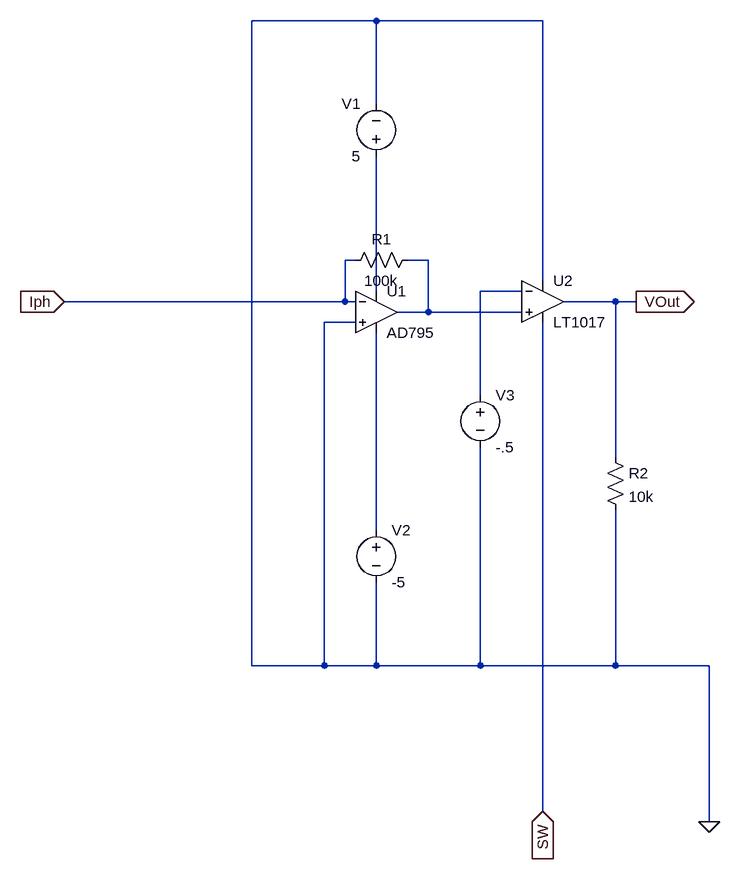
[diagram p0: schematic Synapse_v2.asc]
Synapse_v2.asc, the LTspice schematic file:
Version 4
SHEET 1 980 916
WIRE 272 -384 80 -384
WIRE 528 -384 272 -384
WIRE 272 -256 272 -384
WIRE 240 -16 224 -16
WIRE 352 -16 320 -16
WIRE 528 16 528 -384
WIRE 272 32 272 -176
WIRE 496 32 432 32
WIRE 224 48 224 -16
WIRE 224 48 -208 48
WIRE 240 48 224 48
WIRE 640 48 560 48
WIRE 672 48 640 48
WIRE 352 64 352 -16
WIRE 352 64 304 64
WIRE 496 64 352 64
WIRE 240 80 192 80
WIRE 432 192 432 32
WIRE 640 288 640 48
WIRE 272 400 272 96
WIRE 80 608 80 -384
WIRE 192 608 192 80
WIRE 192 608 80 608
WIRE 272 608 272 480
WIRE 272 608 192 608
WIRE 432 608 432 272
WIRE 432 608 272 608
WIRE 640 608 640 368
WIRE 640 608 432 608
WIRE 784 608 640 608
WIRE 528 832 528 80
WIRE 784 848 784 608
FLAG 784 848 0
FLAG 528 832 SW
IOPIN 528 832 In
FLAG -208 48 Iph
IOPIN -208 48 In
FLAG 672 48 VOut
IOPIN 672 48 Out
SYMBOL Opamps/AD795 272 0 R0
SYMATTR InstName U1
SYMBOL voltage 272 -160 R180
WINDOW 0 24 96 Left 2
WINDOW 3 24 16 Left 2
SYMATTR InstName V1
SYMATTR Value 5
SYMBOL voltage 272 384 R0
SYMATTR InstName V2
SYMATTR Value -5
SYMBOL res 336 -32 R90
WINDOW 0 0 56 VBottom 2
WINDOW 3 32 56 VTop 2
SYMATTR InstName R1
SYMATTR Value 100k
SYMBOL voltage 432 176 R0
SYMATTR InstName V3
SYMATTR Value -.5
SYMBOL Comparators/LT1017 528 48 R0
SYMATTR InstName U2
SYMBOL res 624 272 R0
SYMATTR InstName R2
SYMATTR Value 10k

The netlist it stands for:
* Synapse_v2.asc
XU1 0 Iph N002 N004 N001 AD795  ; pins In+ In- V+ V- OUT
V1 N002 0 5
V2 N004 0 -5
R1 N001 Iph 100k
V3 N003 0 -.5
XU2 N001 N003 0 SW VOut LT1017  ; pins In+ In- V+ V- OUT
R2 VOut 0 10k
.lib ADI1.lib
.backanno
.end